# EAGLE design hello.CMSIS-DAP.10.D11C (EAGLE 9.7.0)
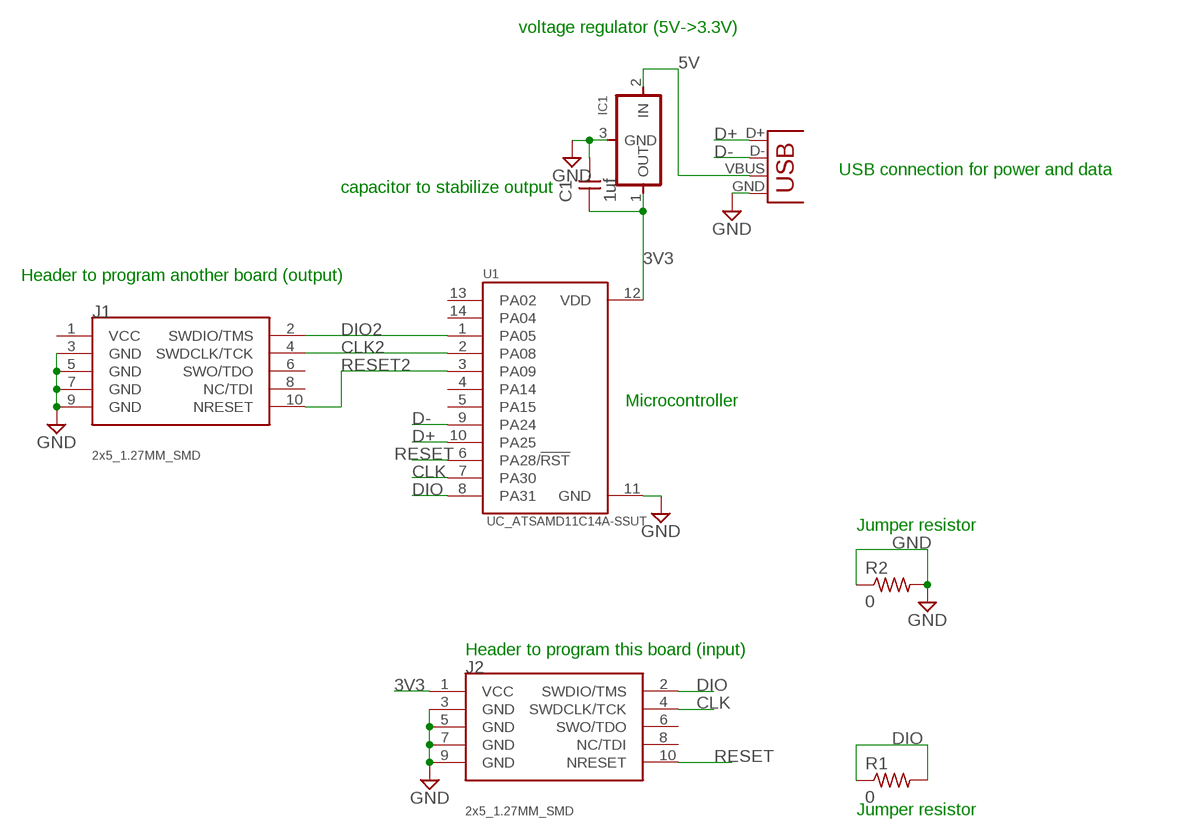
[diagram p0: schematic, sheet 1]

## Parts
C1  1uf  CAP_UNPOLARIZEDFAB  [C1206FAB]
IC1  VR_REGULATOR-SOT23SOT23  [SOT23]
J1  CONN_05X2_ARM_DEBUGSMD  [2X5_1.27MM_SMD]
J2  CONN_05X2_ARM_DEBUGSMD  [2X5_1.27MM_SMD]
R1  0  R1206FAB  [R1206FAB]
R2  0  R1206FAB  [R1206FAB]
U1  UC_ATSAMD11C14A-SSUT  [SOIC127P600X160-14N]
X1  CONN_USB-A-LC  [USB-A_LC]

## Nets
3V3: C1.1 IC1.1(OUT) J2.1(VCC) U1.12(VDD)
5V: IC1.2(IN) X1.VBUS
CLK: J2.4(SWDCLK/TCK) U1.7(PA30)
CLK2: J1.4(SWDCLK/TCK) U1.2(PA08)
D+: U1.10(PA25) X1.D+
D-: U1.9(PA24) X1.D-
DIO: J2.2(SWDIO/TMS) R1.1 R1.2 U1.8(PA31)
DIO2: J1.2(SWDIO/TMS) U1.1(PA05)
GND: C1.2 IC1.3(GND) J1.3(GND) J1.5(GND) J1.7(GND) J1.9(GND) J2.3(GND) J2.5(GND) J2.7(GND) J2.9(GND) R2.1 R2.2 U1.11(GND) X1.GND
RESET: J2.10(NRESET) U1.6(PA28/!RST)
RESET2: J1.10(NRESET) U1.3(PA09)
Unconnected: J1.1(VCC) J1.6(SWO/TDO) J1.8(NC/TDI) J2.6(SWO/TDO) J2.8(NC/TDI) U1.4(PA14) U1.5(PA15) U1.13(PA02) U1.14(PA04)

## Notes on the sheet
- voltage regulator (5V->3.3V)
- USB connection for power and data
- capacitor to stabilize output
- Header to program another board (output)
- Microcontroller
- Jumper resistor
- Header to program this board (input)
- Jumper resistor

## Library data of the parts
C1 = fab:CAP_UNPOLARIZED
IC1 = fab:VR_REGULATOR-SOT23
J1 J2 = fab:CONN_05X2_ARM_DEBUG; PACKAGE: 2x5_1.27MM_SMD
R1 R2 = fab:R: Resistor (US Symbol) Variants with postfix FAB are widened to allow the routing of internal traces
U1 = fab:UC_ATSAMD11C14A-SSUT: MCU 32-Bit SAM D11 ARM Cortex M0+ RISC 16KB Flash 1.8V/2.5V/3.3V 14-Pin SOIC T/R Check prices <https://pricing.snapeda.com/parts/ATSAMD11C14A-SSUT/Microchip/view-part?ref=eda>; AVAILABILITY: In Stock; DESCRIPTION: ARM® Cortex®-M0+ SAM D11C Microcontroller IC 32-Bit 48MHz 16KB (16K x 8) FLASH 14-SOIC; MF: Microchip; MP: ATSAMD11C14A-SSUT; PACKAGE: SOIC-14 Microchip; PRICE: None; PURCHASE-URL: https://pricing.snapeda.com/search/part/ATSAMD11C14A-SSUT/?ref=eda
X1 = fab:CONN_USB: USB Connectors USB-B-PTH is fully proven SKU : PRT-00139 USB-miniB is fully proven SKU : PRT-00587 USB-A-PCB is untested. USB-A-H is throughly reviewed, but untested. Spark Fun Electronics SKU : PRT-00437 USB-B-SMT is throughly reviewed, but untested. Needs silkscreen touching up. USB-A-S has not been used/tested USB-MB-H has not been used/tested

## Board
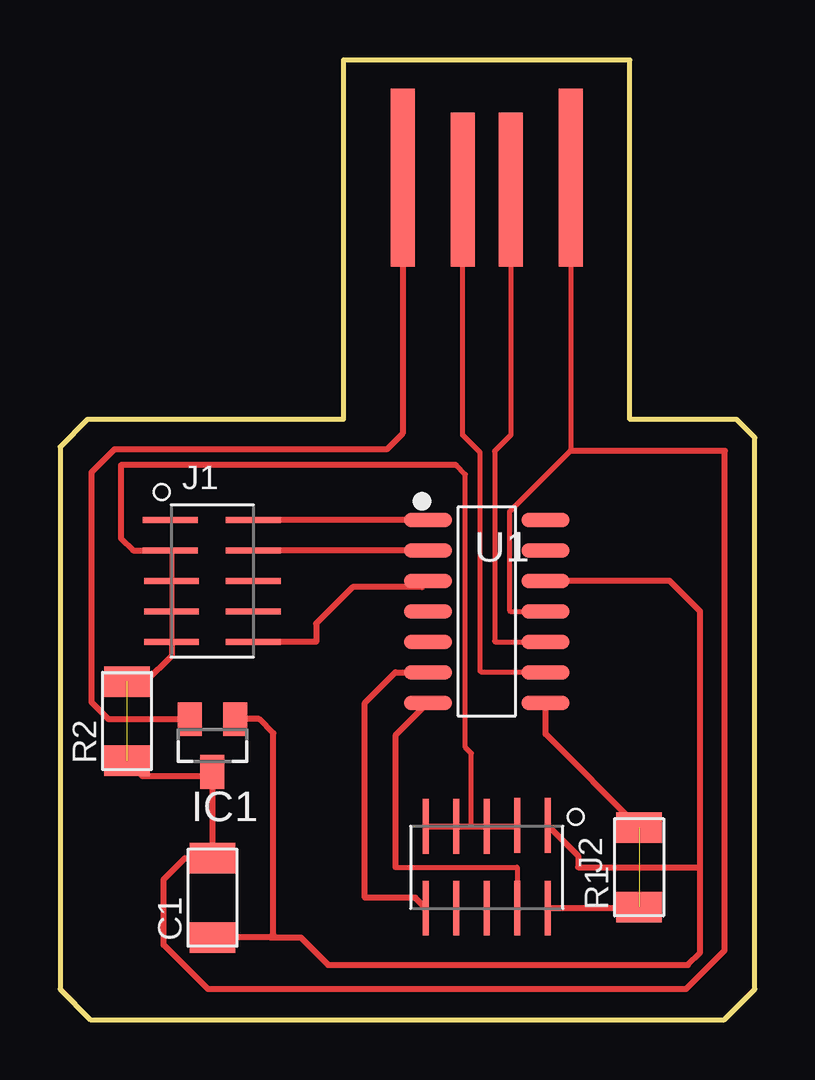
[diagram p1: board, top side]

Size 28.96 x 40.01 mm. Coordinates in mm from the lower left corner, seen from the top.
Outline: 23.75,25.02 23.75,40.01 11.81,40.01 11.81,25.02 1.14,25.02 0,23.88 0,1.27 1.27,0 27.69,0 28.96,1.27 28.96,24.26 28.19,25.02 23.75,25.02
Copper layers (1*16): Top / Bottom
Stack-up Default Layer Stack: Top User Defined 0.035mm / Dielectric-1 User Defined 1.5mm / Bottom User Defined 0.035mm
Design rules "default *": minimum track width 6mil, minimum drill 0.35mm, track to track 16mil, track to pad 16mil, pad to pad 16mil, via to via 16mil, smd to smd 6mil, copper to edge 40mil, drill to drill 6mil, minimum pad ring 10mil, minimum via ring 8mil, stop-mask expansion 4mil, vias tented up to drill 0mil, thermal gap 10mil

### Footprints (pad centres in the part's own frame; a part is rotated, then mirrored left to right if it is on the bottom)
C1206FAB = smd 1.27 x 1.905: 1 -1.651,0; 2 1.651,0
SOT23 = smd 1 x 1.4: 1 -0.95,-1.1; 2 0.95,-1.1; 3 0,1.1
2X5_1.27MM_SMD = smd 2.286 x 0.254: 1 -1.752,2.54; 2 1.702,2.54; 3 -1.752,1.27; 4 1.702,1.27; 5 -1.702,0; 6 1.702,0; 7 -1.702,-1.27; 8 1.702,-1.27; 9 -1.702,-2.54; 10 1.702,-2.54
R1206FAB = smd 1.27 x 1.905: 1 -1.651,0; 2 1.651,0
SOIC127P600X160-14N = smd 2 x 0.6: 1 -2.45,3.81; 2 -2.45,2.54; 3 -2.45,1.27; 4 -2.45,0; 5 -2.45,-1.27; 6 -2.45,-2.54; 7 -2.45,-3.81; 8 2.45,-3.81; 9 2.45,-2.54; 10 2.45,-1.27; 11 2.45,0; 12 2.45,1.27; 13 2.45,2.54; 14 2.45,3.81
USB-A_LC = smd 6.41 x 1: D+ 5.4,1; D- 5.4,-1 | smd 7.41 x 1: GND 4.9,3.5; VBUS 4.9,-3.5

### Placement (x,y rotation side)
C1  6.35,5.08 90 top
IC1  6.35,11.43 180 top
J1  6.35,18.29 0 top
J2  17.78,6.35 270 top
R1  24.13,6.35 90 top
R2  2.79,12.45 90 top
U1  17.78,17.02 0 top
X1  17.78,40.01 270 top

### Tracks (layer width: path | path; a pad name or v marks a point on that pad's centre or on a via)
3V3
  Top 0.254: J2.1 21.59,6.83 21.59,6.35 26.67,6.35 | 26.67,6.35 26.67,17.02 25.4,18.29 U1.12 | IC1.1 8.3,12.53 8.89,11.94 8.89,3.56 8.76,3.43 | 8.76,3.43 C1.1 | 8.76,3.43 10.03,3.43 11.18,2.29 26.16,2.29 26.67,2.79 26.67,6.35
5V
  Top 0.254: X1.VBUS 14.28,24.44 13.61,23.77 2.27,23.77 1.31,22.82 1.31,13.24 2.02,12.53 IC1.2
CLK
  Top 0.203: 13.97,6.35 19.05,6.35 J2.4
  Top 0.254: U1.7 13.97,11.85 13.97,6.35
CLK2
  Top 0.254: U1.2 J1.4
D+
  Top 0.203: U1.10 18.13,15.75 18.11,15.77 18.11,23.7 18.8,24.38 18.8,34.59 X1.D+
D-
  Top 0.203: X1.D- 16.78,24.37 17.5,23.65 17.5,14.53 17.55,14.48 U1.9
DIO  (2 unrouted)
  Top 0.254: R1.1 24.08,4.65 J2.2 | R1.2 20.23,11.9 U1.8
DIO2
  Top 0.254: U1.1 J1.2
GND  (1 unrouted)
  Top 0.203: U1.11 18.77,17.02 18.72,17.06 18.72,21.16 21.28,23.72 X1.GND | 16.51,23.11 16.89,22.73 16.89,11.35 17.14,11.1 17.14,8.05 | J1.3 4.65,19.51 J1.5 J1.7 J1.9
  Top 0.254: J2.9 J2.7 17.14,8.05 J2.5 19,8.05 J2.3 | 16.51,23.11 2.54,23.11 2.54,20.07 3.05,19.56 J1.3 | IC1.3 6.35,10.16 | 6.35,10.16 C1.2 5.21,6.73 4.32,5.84 4.32,3.12 6.17,1.27 26.08,1.27 27.69,2.88 27.69,23.72 | 21.28,23.72 27.69,23.72 | J1.9 4.65,15.16 3.58,14.1 R2.2 | R2.1 3.43,10.16 6.35,10.16 | 27.69,23.72 27.71,23.72
RESET
  Top 0.254: J2.10 14.81,5.08 12.7,5.08 12.7,13.21 13.97,14.48 U1.6
RESET2
  Top 0.254: U1.3 15.08,18.03 12.19,18.03 10.67,16.51 10.67,15.75 J1.10